# EAGLE design stm32f405_card (EAGLE 8.0.2)
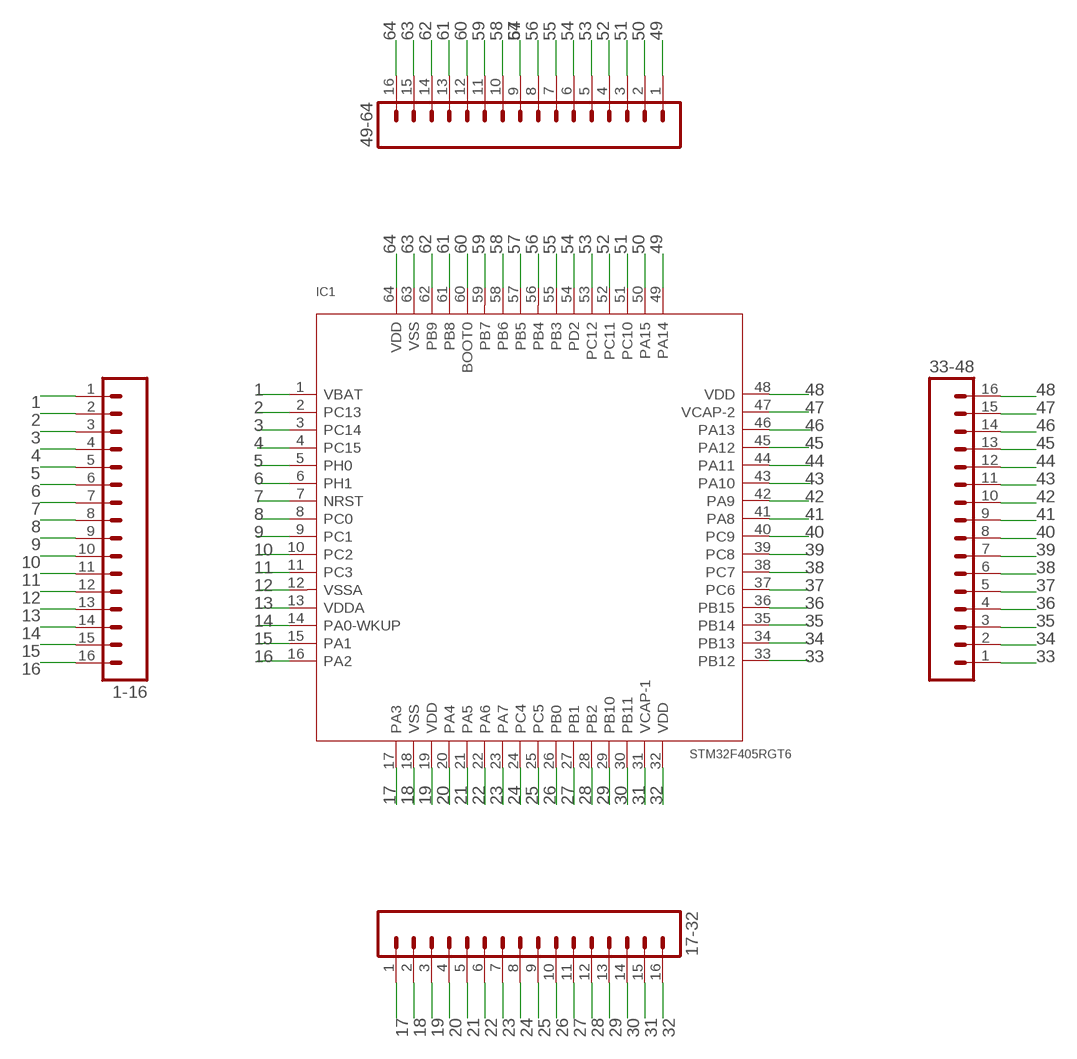
[diagram p0: schematic, sheet 1]

## Parts
1-16  M16PTH_SQ_BOTTOM  [1X16_SQ_BOTTOM]
17-32  M16PTH_BOTTOM  [1X16_BOTTOM]
33-48  M16PTH_BOTTOM  [1X16_BOTTOM]
49-64  M16PTH_BOTTOM  [1X16_BOTTOM]
IC1  STM32F405RGT6  MCU-STM32F405RGT6(LQFP64)  [LQFP64-0.5-10X10MM]

## Nets
1: 1-16.1 IC1.1(VBAT)
2: 1-16.2 IC1.2(PC13)
3: 1-16.3 IC1.3(PC14)
4: 1-16.4 IC1.4(PC15)
5: 1-16.5 IC1.5(PH0)
6: 1-16.6 IC1.6(PH1)
7: 1-16.7 IC1.7(NRST)
8: 1-16.8 IC1.8(PC0)
9: 1-16.9 IC1.9(PC1)
10: 1-16.10 IC1.10(PC2)
11: 1-16.11 IC1.11(PC3)
12: 1-16.12 IC1.12(VSSA)
13: 1-16.13 IC1.13(VDDA)
14: 1-16.14 IC1.14(PA0-WKUP)
15: 1-16.15 IC1.15(PA1)
16: 1-16.16 IC1.16(PA2)
17: 17-32.1 IC1.17(PA3)
18: 17-32.2 IC1.18(VSS)
19: 17-32.3 IC1.19(VDD)
20: 17-32.4 IC1.20(PA4)
21: 17-32.5 IC1.21(PA5)
22: 17-32.6 IC1.22(PA6)
23: 17-32.7 IC1.23(PA7)
24: 17-32.8 IC1.24(PC4)
25: 17-32.9 IC1.25(PC5)
26: 17-32.10 IC1.26(PB0)
27: 17-32.11 IC1.27(PB1)
28: 17-32.12 IC1.28(PB2)
29: 17-32.13 IC1.29(PB10)
30: 17-32.14 IC1.30(PB11)
31: 17-32.15 IC1.31(VCAP-1)
32: 17-32.16 IC1.32(VDD)
33: 33-48.1 IC1.33(PB12)
34: 33-48.2 IC1.34(PB13)
35: 33-48.3 IC1.35(PB14)
36: 33-48.4 IC1.36(PB15)
37: 33-48.5 IC1.37(PC6)
38: 33-48.6 IC1.38(PC7)
39: 33-48.7 IC1.39(PC8)
40: 33-48.8 IC1.40(PC9)
41: 33-48.9 IC1.41(PA8)
42: 33-48.10 IC1.42(PA9)
43: 33-48.11 IC1.43(PA10)
44: 33-48.12 IC1.44(PA11)
45: 33-48.13 IC1.45(PA12)
46: 33-48.14 IC1.46(PA13)
47: 33-48.15 IC1.47(VCAP-2)
48: 33-48.16 IC1.48(VDD)
49: 49-64.1 IC1.49(PA14)
50: 49-64.2 IC1.50(PA15)
51: 49-64.3 IC1.51(PC10)
52: 49-64.4 IC1.52(PC11)
53: 49-64.5 IC1.53(PC12)
54: 49-64.6 IC1.54(PD2)
55: 49-64.7 IC1.55(PB3)
56: 49-64.8 IC1.56(PB4)
57: 49-64.9 IC1.57(PB5)
58: 49-64.10 IC1.58(PB6)
59: 49-64.11 IC1.59(PB7)
60: 49-64.12 IC1.60(BOOT0)
61: 49-64.13 IC1.61(PB8)
62: 49-64.14 IC1.62(PB9)
63: 49-64.15 IC1.63(VSS)
64: 49-64.16 IC1.64(VDD)

## Library data of the parts
1-16 17-32 33-48 49-64 = krok:M16: 1x16 .1" header
IC1 = Seeed-OPL-ic:MCU-STM32F405RGT6(LQFP64): 310010070; MPN: STM32F405RGT6; VALUE: STM32F405RGT6-lqfp64

## Net classes
1 power: width 0.305 mm

## Board
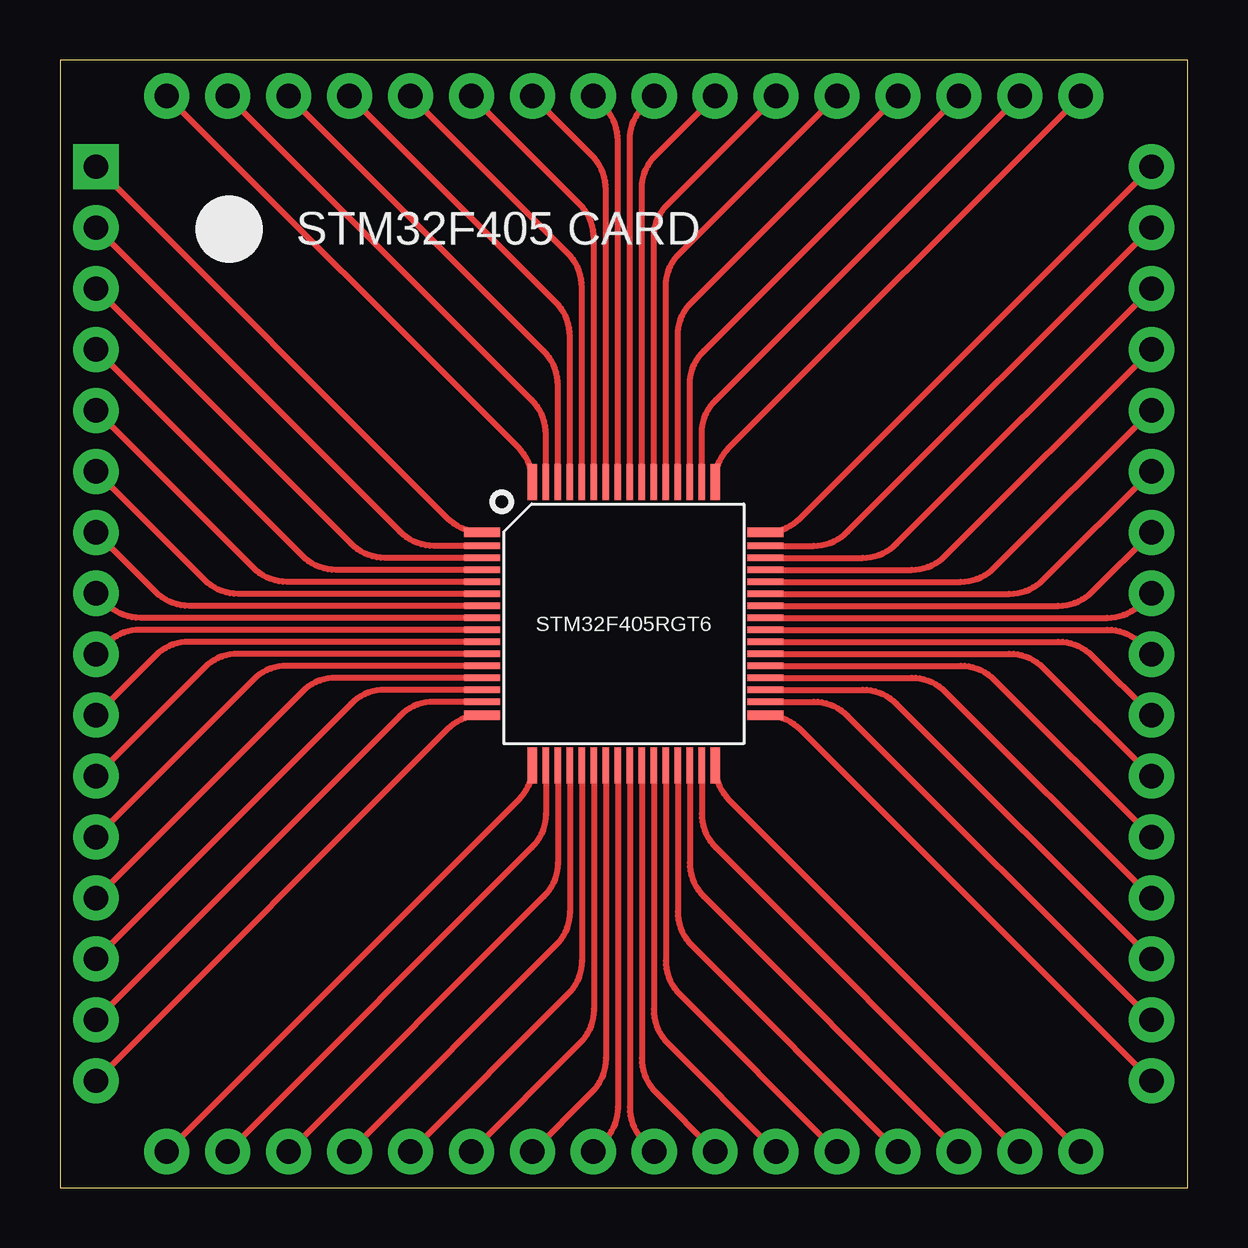
[diagram p1: board, top side]
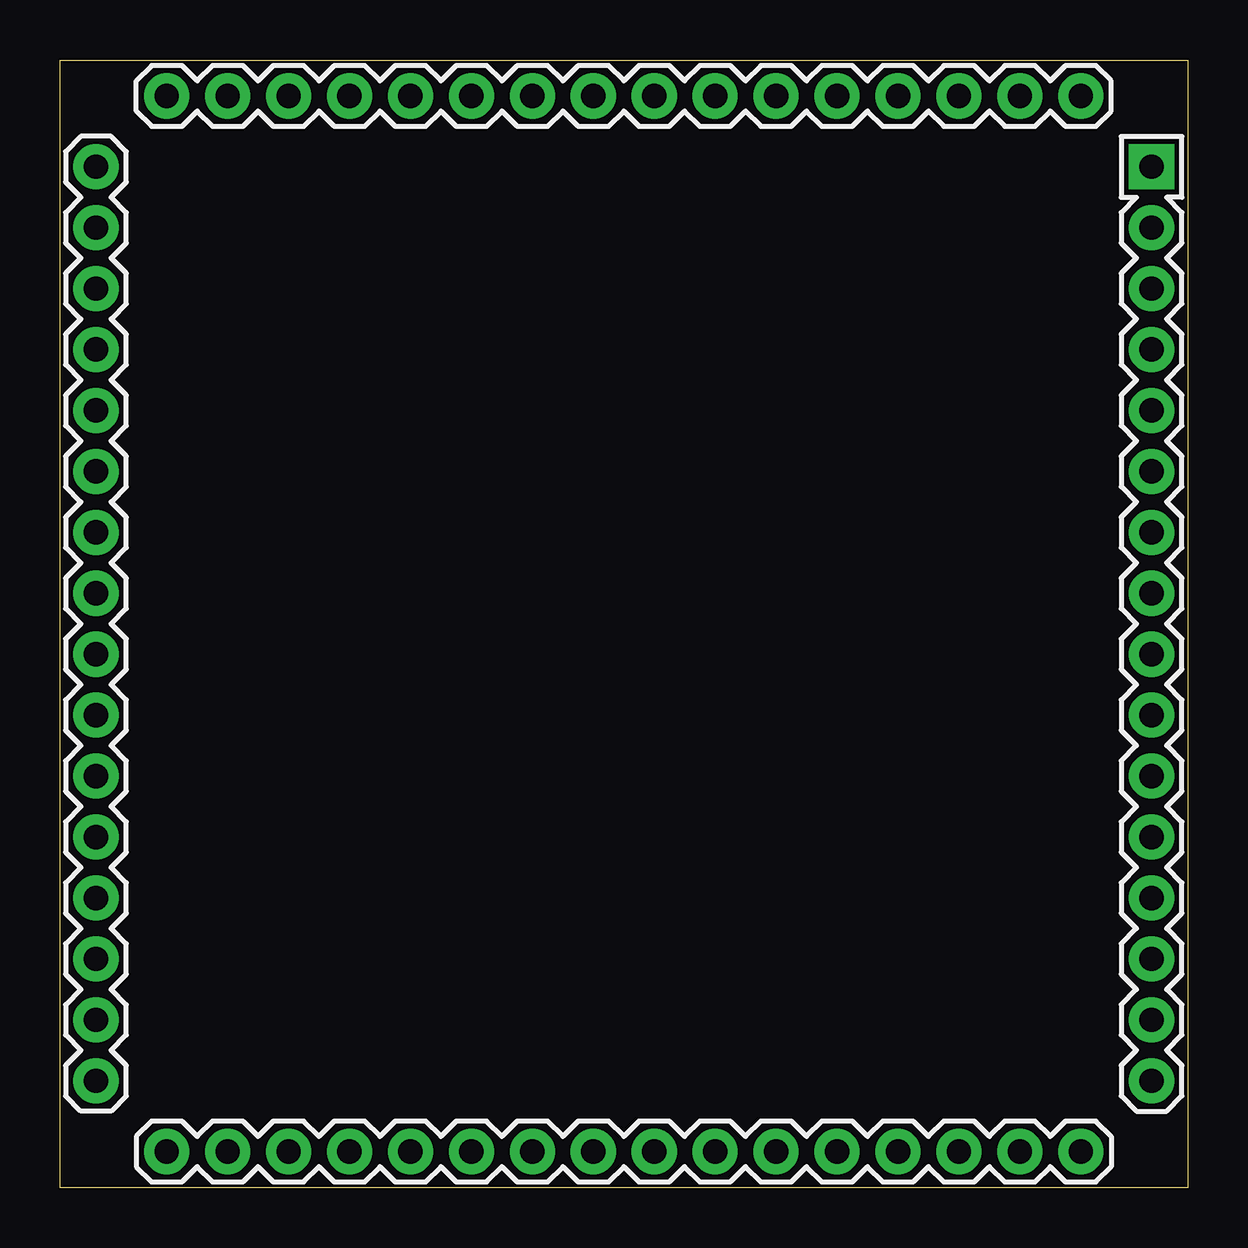
[diagram p2: board, bottom side, seen from below]

Size 47 x 47 mm. Coordinates in mm from the lower left corner, seen from the top.
Outline: 0,0 47,0 47,47 0,47 0,0
Copper layers (1*16): Top 0.0356mm / dielectric 1.5011mm / Bottom 0.0356mm
Design rules "LaenPCBOrder *": minimum track width 6mil, minimum drill 13mil, track to track 6mil, track to pad 6mil, pad to pad 6mil, via to via 6mil, smd to smd 6mil, copper to edge 15mil, drill to drill 6mil, minimum pad ring 7mil, minimum via ring 7mil, stop-mask expansion 3mil, vias tented up to drill 0mil, thermal gap 10mil

### Footprints (pad centres in the part's own frame; a part is rotated, then mirrored left to right if it is on the bottom)
1X16_SQ_BOTTOM = drill 1.016 pad 1.88 square: 1 0,0 | drill 1.016 pad 1.88: 2 2.54,0; 3 5.08,0; 4 7.62,0; 5 10.16,0; 6 12.7,0; 7 15.24,0; 8 17.78,0; 9 20.32,0; 10 22.86,0; 11 25.4,0; 12 27.94,0; 13 30.48,0; 14 33.02,0; 15 35.56,0; 16 38.1,0
1X16_BOTTOM = drill 1.016 pad 1.88: 1 0,0; 2 2.54,0; 3 5.08,0; 4 7.62,0; 5 10.16,0; 6 12.7,0; 7 15.24,0; 8 17.78,0; 9 20.32,0; 10 22.86,0; 11 25.4,0; 12 27.94,0; 13 30.48,0; 14 33.02,0; 15 35.56,0; 16 38.1,0
LQFP64-0.5-10X10MM = smd 1.5 x 0.4: 1 -5.9,3.81; 16 -5.9,-3.81; 33 5.9,-3.81; 48 5.9,3.81 | smd 1.5 x 0.28: 2 -5.9,3.25; 3 -5.9,2.75; 4 -5.9,2.25; 5 -5.9,1.75; 6 -5.9,1.25; 7 -5.9,0.75; 8 -5.9,0.25; 9 -5.9,-0.25; 10 -5.9,-0.75; 11 -5.9,-1.25; 12 -5.9,-1.75; 13 -5.9,-2.25; 14 -5.9,-2.75; 15 -5.9,-3.25; 34 5.9,-3.25; 35 5.9,-2.75; 36 5.9,-2.25; 37 5.9,-1.75; 38 5.9,-1.25; 39 5.9,-0.75; 40 5.9,-0.25; 41 5.9,0.25; 42 5.9,0.75; 43 5.9,1.25; 44 5.9,1.75; 45 5.9,2.25; 46 5.9,2.75; 47 5.9,3.25 | smd 0.4 x 1.5: 17 -3.81,-5.9; 32 3.81,-5.9; 49 3.81,5.9; 64 -3.81,5.9 | smd 0.28 x 1.5: 18 -3.25,-5.9; 19 -2.75,-5.9; 20 -2.25,-5.9; 21 -1.75,-5.9; 22 -1.25,-5.9; 23 -0.75,-5.9; 24 -0.25,-5.9; 25 0.25,-5.9; 26 0.75,-5.9; 27 1.25,-5.9; 28 1.75,-5.9; 29 2.25,-5.9; 30 2.75,-5.9; 31 3.25,-5.9; 50 3.25,5.9; 51 2.75,5.9; 52 2.25,5.9; 53 1.75,5.9; 54 1.25,5.9; 55 0.75,5.9; 56 0.25,5.9; 57 -0.25,5.9; 58 -0.75,5.9; 59 -1.25,5.9; 60 -1.75,5.9; 61 -2.25,5.9; 62 -2.75,5.9; 63 -3.25,5.9

### Placement (x,y rotation side)
1-16  1.5,42.55 270 top
17-32  4.45,1.5 0 top
33-48  45.5,4.45 90 top
49-64  42.55,45.5 180 top
IC1  23.5,23.5 0 top

### Tracks (layer width: path | path; a pad name or v marks a point on that pad's centre or on a via)
1
  Top 0.254: IC1.1 17.57,27.31 arc-45 16.15,27.9 1-16.1
2
  Top 0.254: IC1.2 15.59,26.75 arc-45 14.17,27.34 1-16.2
3
  Top 0.254: IC1.3 13.55,26.25 arc-45 12.13,26.84 1-16.3
4
  Top 0.254: IC1.4 11.51,25.75 arc-45 10.09,26.34 1-16.4
5
  Top 0.254: IC1.5 9.47,25.25 arc-45 8.05,25.84 1-16.5
6
  Top 0.254: IC1.6 7.43,24.75 arc-45 6.01,25.34 1-16.6
7
  Top 0.254: IC1.7 5.39,24.25 arc-45 3.97,24.84 1-16.7
8
  Top 0.254: IC1.8 3.35,23.75 arc-45 1.93,24.34 1-16.8
9
  Top 0.254: IC1.9 3.35,23.25 arc45 1.93,22.66 1-16.9
10
  Top 0.254: IC1.10 5.39,22.75 arc45 3.97,22.16 1-16.10
11
  Top 0.254: IC1.11 7.43,22.25 arc45 6.01,21.66 1-16.11
12
  Top 0.254: IC1.12 9.47,21.75 arc45 8.05,21.16 1-16.12
13
  Top 0.254: IC1.13 11.51,21.25 arc45 10.09,20.66 1-16.13
14
  Top 0.254: IC1.14 13.55,20.75 arc45 12.13,20.16 1-16.14
15
  Top 0.254: IC1.15 15.59,20.25 arc45 14.17,19.66 1-16.15
16
  Top 0.254: IC1.16 17.57,19.69 arc45 16.15,19.1 1-16.16
17
  Top 0.254: IC1.17 19.69,17.57 arc-45 19.1,16.15 17-32.1
18
  Top 0.254: IC1.18 20.25,15.59 arc-45 19.66,14.17 17-32.2
19
  Top 0.254: IC1.19 20.75,13.55 arc-45 20.16,12.13 17-32.3
20
  Top 0.254: IC1.20 21.25,11.51 arc-45 20.66,10.09 17-32.4
21
  Top 0.254: IC1.21 21.75,9.47 arc-45 21.16,8.05 17-32.5
22
  Top 0.254: IC1.22 22.25,7.43 arc-45 21.66,6.01 17-32.6
23
  Top 0.254: IC1.23 22.75,5.39 arc-45 22.16,3.97 17-32.7
24
  Top 0.254: IC1.24 23.25,3.35 arc-45 22.66,1.93 17-32.8
25
  Top 0.254: IC1.25 23.75,3.35 arc45 24.34,1.93 17-32.9
26
  Top 0.254: IC1.26 24.25,5.39 arc45 24.84,3.97 17-32.10
27
  Top 0.254: IC1.27 24.75,7.43 arc45 25.34,6.01 17-32.11
28
  Top 0.254: IC1.28 25.25,9.47 arc45 25.84,8.05 17-32.12
29
  Top 0.254: IC1.29 25.75,11.51 arc45 26.34,10.09 17-32.13
30
  Top 0.254: IC1.30 26.25,13.55 arc45 26.84,12.13 17-32.14
31
  Top 0.254: IC1.31 26.75,15.59 arc45 27.34,14.17 17-32.15
32
  Top 0.254: IC1.32 27.31,17.57 arc45 27.9,16.15 17-32.16
33
  Top 0.254: IC1.33 29.43,19.69 arc-45 30.85,19.1 33-48.1
34
  Top 0.254: IC1.34 31.41,20.25 arc-45 32.83,19.66 33-48.2
35
  Top 0.254: IC1.35 33.45,20.75 arc-45 34.87,20.16 33-48.3
36
  Top 0.254: IC1.36 35.49,21.25 arc-45 36.91,20.66 33-48.4
37
  Top 0.254: IC1.37 37.53,21.75 arc-45 38.95,21.16 33-48.5
38
  Top 0.254: IC1.38 39.57,22.25 arc-45 40.99,21.66 33-48.6
39
  Top 0.254: IC1.39 41.61,22.75 arc-45 43.03,22.16 33-48.7
40
  Top 0.254: IC1.40 43.65,23.25 arc-45 45.07,22.66 33-48.8
41
  Top 0.254: IC1.41 43.65,23.75 arc45 45.07,24.34 33-48.9
42
  Top 0.254: IC1.42 41.61,24.25 arc45 43.03,24.84 33-48.10
43
  Top 0.254: IC1.43 39.57,24.75 arc45 40.99,25.34 33-48.11
44
  Top 0.254: IC1.44 37.53,25.25 arc45 38.95,25.84 33-48.12
45
  Top 0.254: IC1.45 35.49,25.75 arc45 36.91,26.34 33-48.13
46
  Top 0.254: IC1.46 33.45,26.25 arc45 34.87,26.84 33-48.14
47
  Top 0.254: IC1.47 31.41,26.75 arc45 32.83,27.34 33-48.15
48
  Top 0.254: IC1.48 29.43,27.31 arc45 30.85,27.9 33-48.16
49
  Top 0.254: IC1.49 27.31,29.43 arc-45 27.9,30.85 49-64.1
50
  Top 0.254: IC1.50 26.75,31.41 arc-45 27.34,32.83 49-64.2
51
  Top 0.254: IC1.51 26.25,33.45 arc-45 26.84,34.87 49-64.3
52
  Top 0.254: IC1.52 25.75,35.49 arc-45 26.34,36.91 49-64.4
53
  Top 0.254: IC1.53 25.25,37.53 arc-45 25.84,38.95 49-64.5
54
  Top 0.254: IC1.54 24.75,39.57 arc-45 25.34,40.99 49-64.6
55
  Top 0.254: IC1.55 24.25,41.61 arc-45 24.84,43.03 49-64.7
56
  Top 0.254: IC1.56 23.75,43.65 arc-45 24.34,45.07 49-64.8
57
  Top 0.254: IC1.57 23.25,43.65 arc45 22.66,45.07 49-64.9
58
  Top 0.254: IC1.58 22.75,41.61 arc45 22.16,43.03 49-64.10
59
  Top 0.254: IC1.59 22.25,39.57 arc45 21.66,40.99 49-64.11
60
  Top 0.254: IC1.60 21.75,37.53 arc45 21.16,38.95 49-64.12
61
  Top 0.254: IC1.61 21.25,35.49 arc45 20.66,36.91 49-64.13
62
  Top 0.254: IC1.62 20.75,33.45 arc45 20.16,34.87 49-64.14
63
  Top 0.254: IC1.63 20.25,31.41 arc45 19.66,32.83 49-64.15
64
  Top 0.254: IC1.64 19.69,29.43 arc45 19.1,30.85 49-64.16

### Text on the board
tPlace: STM32F405 CARD